# EAGLE design Servo2015_Power_V1.2 (EAGLE 6.3)

## Sheet 1 of 4
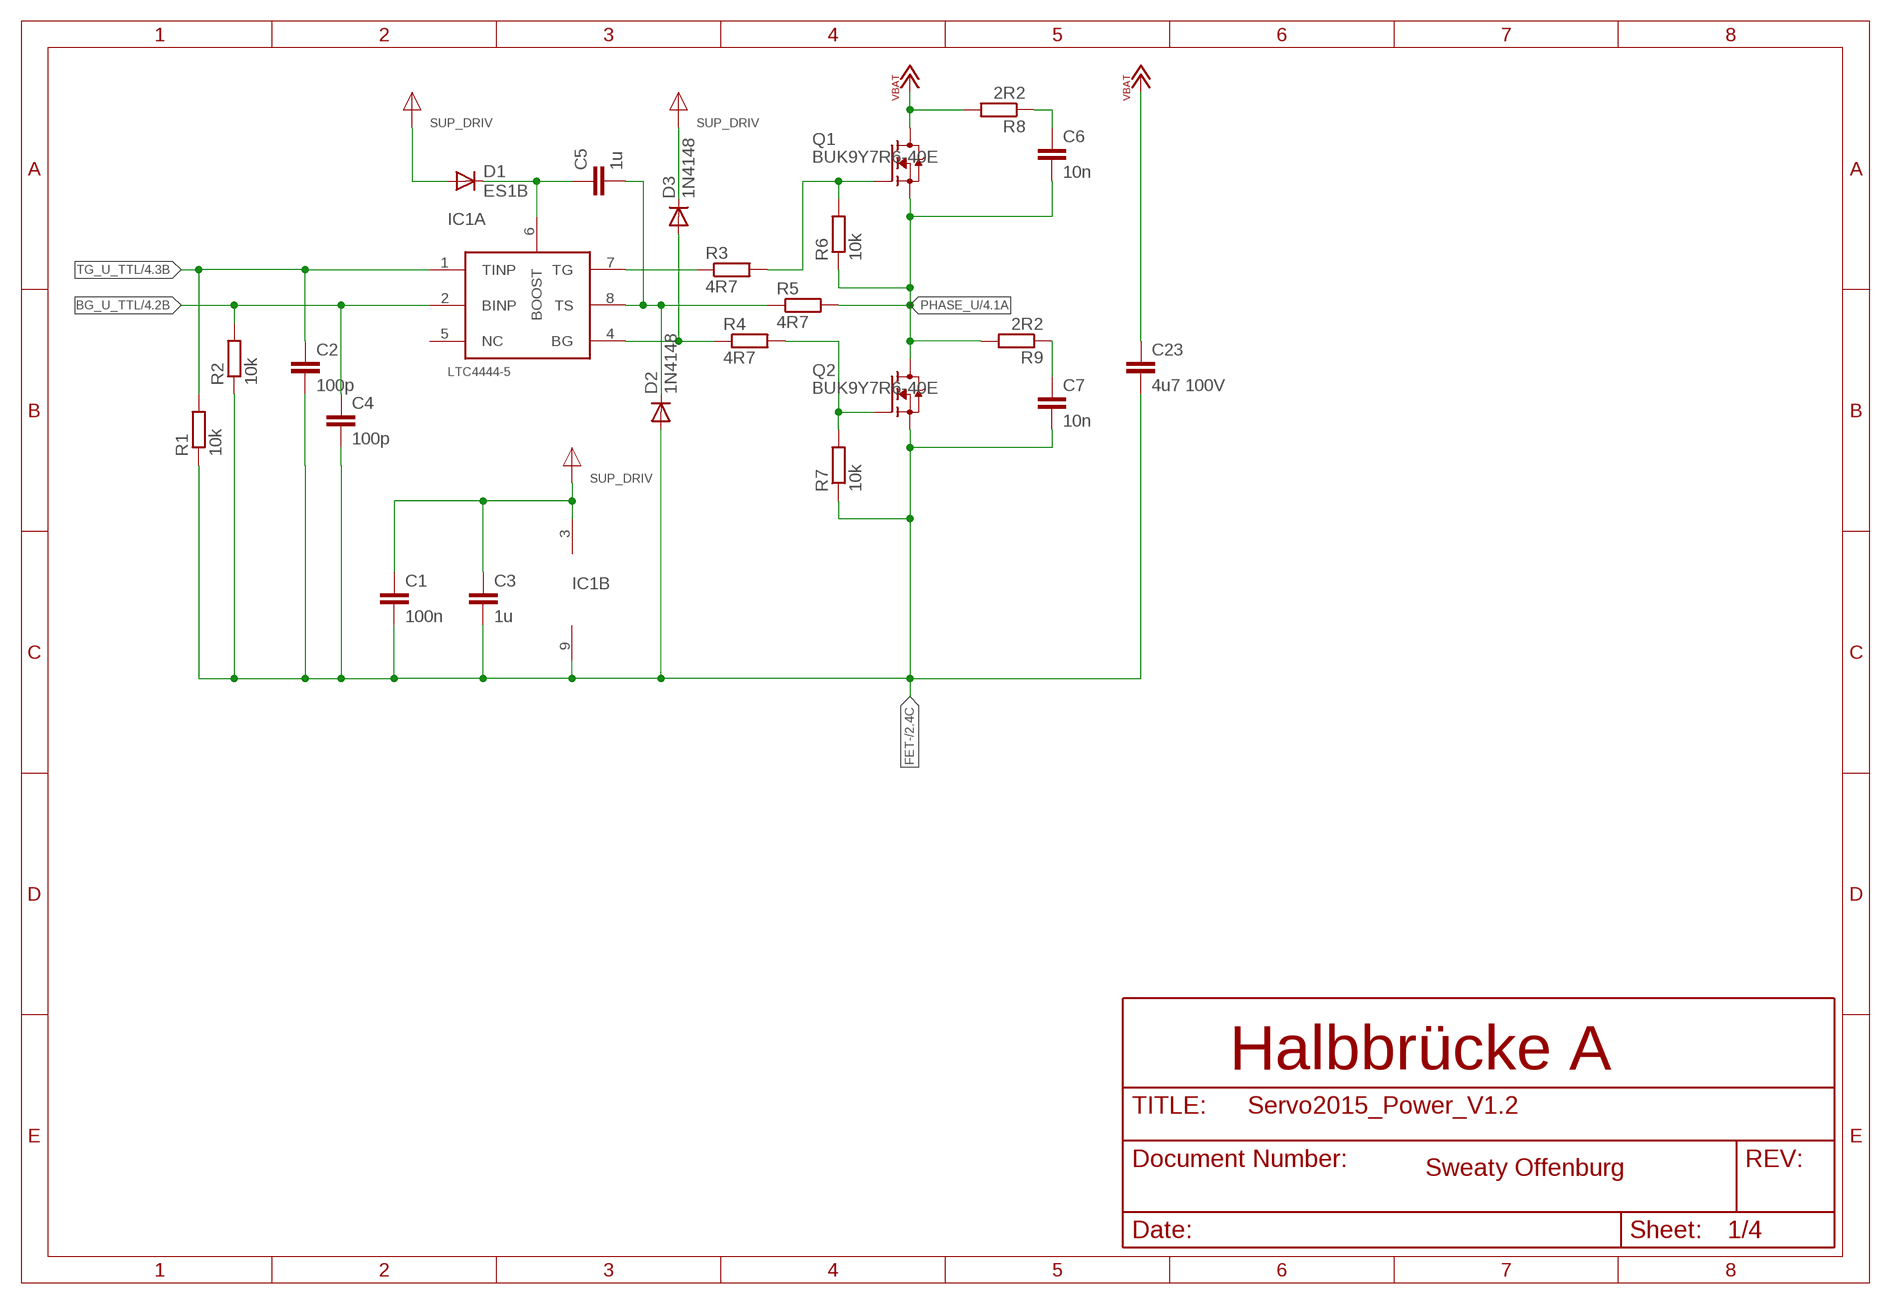
[diagram p0: schematic, sheet 1]

### Parts
C1  100n  C-EUC0603  [C0603]
C2  100p  C-EUC0603  [C0603]
C3  1u  C-EUC0603  [C0603]
C4  100p  C-EUC0603  [C0603]
C5  1u  C-EUC0603  [C0603]
C6  10n  C-EUC1210  [C1210]
C7  10n  C-EUC1210  [C1210]
C23  4u7 100V  C-EUC2220K  [C2220K]
D1  ES1B  DIODE-DO214AC  [DO214AC]
D2  1N4148  DIODE-SOD123  [SOD123]
D3  1N4148  DIODE-SOD123  [SOD123]
IC1  LTC4444-5  [MS8E]
Q1  BUK9Y7R6-40E  [LFPAK56]
Q2  BUK9Y7R6-40E  [LFPAK56]
R1  10k  R-EU_R0603  [R0603]
R2  10k  R-EU_R0603  [R0603]
R3  4R7  R-EU_R0805  [R0805]
R4  4R7  R-EU_R0805  [R0805]
R5  4R7  R-EU_R0805  [R0805]
R6  10k  R-EU_R0603  [R0603]
R7  10k  R-EU_R0603  [R0603]
R8  2R2  R-EU_R1206  [R1206]
R9  2R2  R-EU_R1206  [R1206]

### Nets
BG_U_TTL: C4.1 IC1.2(A:BINP) R2.2 ; also sheet 4
BGR_A: Q2.4(G) R4.2 R7.2
FET-: C1.2 C2.2 C3.2 C4.2 C7.2 C23.2 D2.A IC1.9(B:GND) Q2.1(S) Q2.2(S) Q2.3(S) R1.1 R2.1 R7.1 ; also sheet 2,3,4
N$4: IC1.7(A:TG) R3.1
N$5: C5.2 D2.C IC1.8(A:TS) R5.1
N$6: D3.A IC1.4(A:BG) R4.1
N$7: C5.1 D1.C IC1.6(A:BOOST)
N$20: C6.1 R8.1
N$55: C7.1 R9.1
PHASE_U: C6.2 Q1.1(S) Q1.2(S) Q1.3(S) Q2.5-8(D) R5.2 R6.1 R9.2 ; also sheet 4
SUP_DRIV: C1.1 C3.1 D1.A D3.C IC1.3(B:VCC) ; also sheet 2,3,4
TG_U_TTL: C2.1 IC1.1(A:TINP) R1.2 ; also sheet 4
TGR_A: Q1.4(G) R3.2 R6.2
VBAT+: C23.1 Q1.5-8(D) R8.2 ; also sheet 2,3,4
Unconnected: IC1.5(A:NC)

### Notes on the sheet
- Halbbrücke A
- Sweaty Offenburg

## Sheet 2 of 4
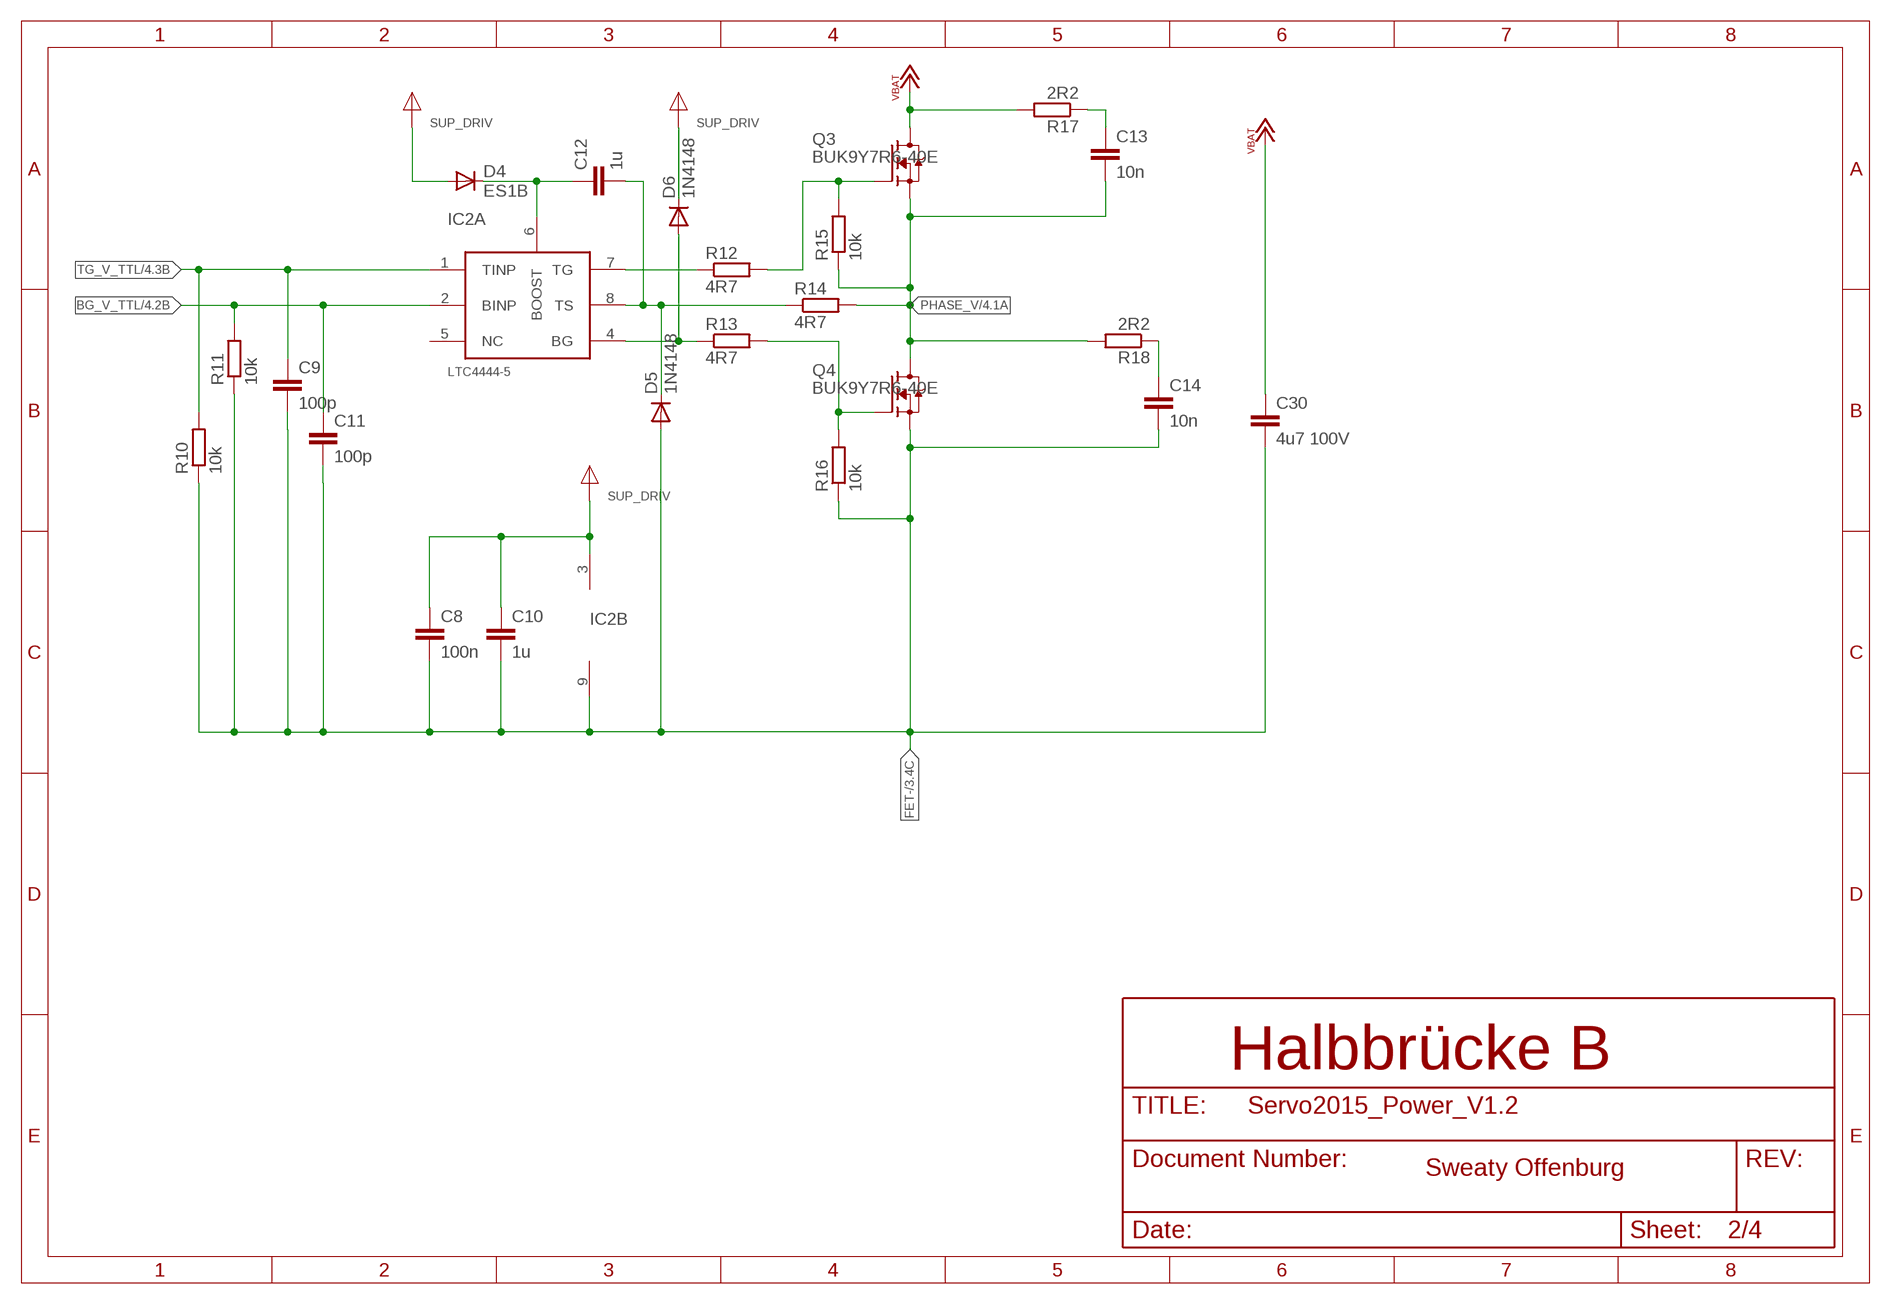
[diagram p1: schematic, sheet 2]

### Parts
C8  100n  C-EUC0603  [C0603]
C9  100p  C-EUC0603  [C0603]
C10  1u  C-EUC0603  [C0603]
C11  100p  C-EUC0603  [C0603]
C12  1u  C-EUC0603  [C0603]
C13  10n  C-EUC1210  [C1210]
C14  10n  C-EUC1210  [C1210]
C30  4u7 100V  C-EUC2220K  [C2220K]
D4  ES1B  DIODE-DO214AC  [DO214AC]
D5  1N4148  DIODE-SOD123  [SOD123]
D6  1N4148  DIODE-SOD123  [SOD123]
IC2  LTC4444-5  [MS8E]
Q3  BUK9Y7R6-40E  [LFPAK56]
Q4  BUK9Y7R6-40E  [LFPAK56]
R10  10k  R-EU_R0603  [R0603]
R11  10k  R-EU_R0603  [R0603]
R12  4R7  R-EU_R0805  [R0805]
R13  4R7  R-EU_R0805  [R0805]
R14  4R7  R-EU_R0805  [R0805]
R15  10k  R-EU_R0603  [R0603]
R16  10k  R-EU_R0603  [R0603]
R17  2R2  R-EU_R1206  [R1206]
R18  2R2  R-EU_R1206  [R1206]

### Nets
BG_V_TTL: C11.1 IC2.2(A:BINP) R11.2 ; also sheet 4
BGR_B: Q4.4(G) R13.2 R16.2
FET-: C8.2 C9.2 C10.2 C11.2 C14.2 C30.2 D5.A IC2.9(B:GND) Q4.1(S) Q4.2(S) Q4.3(S) R10.1 R11.1 R16.1 ; also sheet 1,3,4
N$60: IC2.7(A:TG) R12.1
N$61: C12.2 D5.C IC2.8(A:TS) R14.1
N$62: D6.A IC2.4(A:BG) R13.1
N$63: C12.1 D4.C IC2.6(A:BOOST)
N$71: C13.1 R17.1
N$72: C14.1 R18.1
PHASE_V: C13.2 Q3.1(S) Q3.2(S) Q3.3(S) Q4.5-8(D) R14.2 R15.1 R18.2 ; also sheet 4
SUP_DRIV: C8.1 C10.1 D4.A D6.C IC2.3(B:VCC) ; also sheet 1,3,4
TG_V_TTL: C9.1 IC2.1(A:TINP) R10.2 ; also sheet 4
TGR_B: Q3.4(G) R12.2 R15.2
VBAT+: C30.1 Q3.5-8(D) R17.2 ; also sheet 1,3,4
Unconnected: IC2.5(A:NC)

### Notes on the sheet
- Halbbrücke B
- Sweaty Offenburg

## Sheet 3 of 4
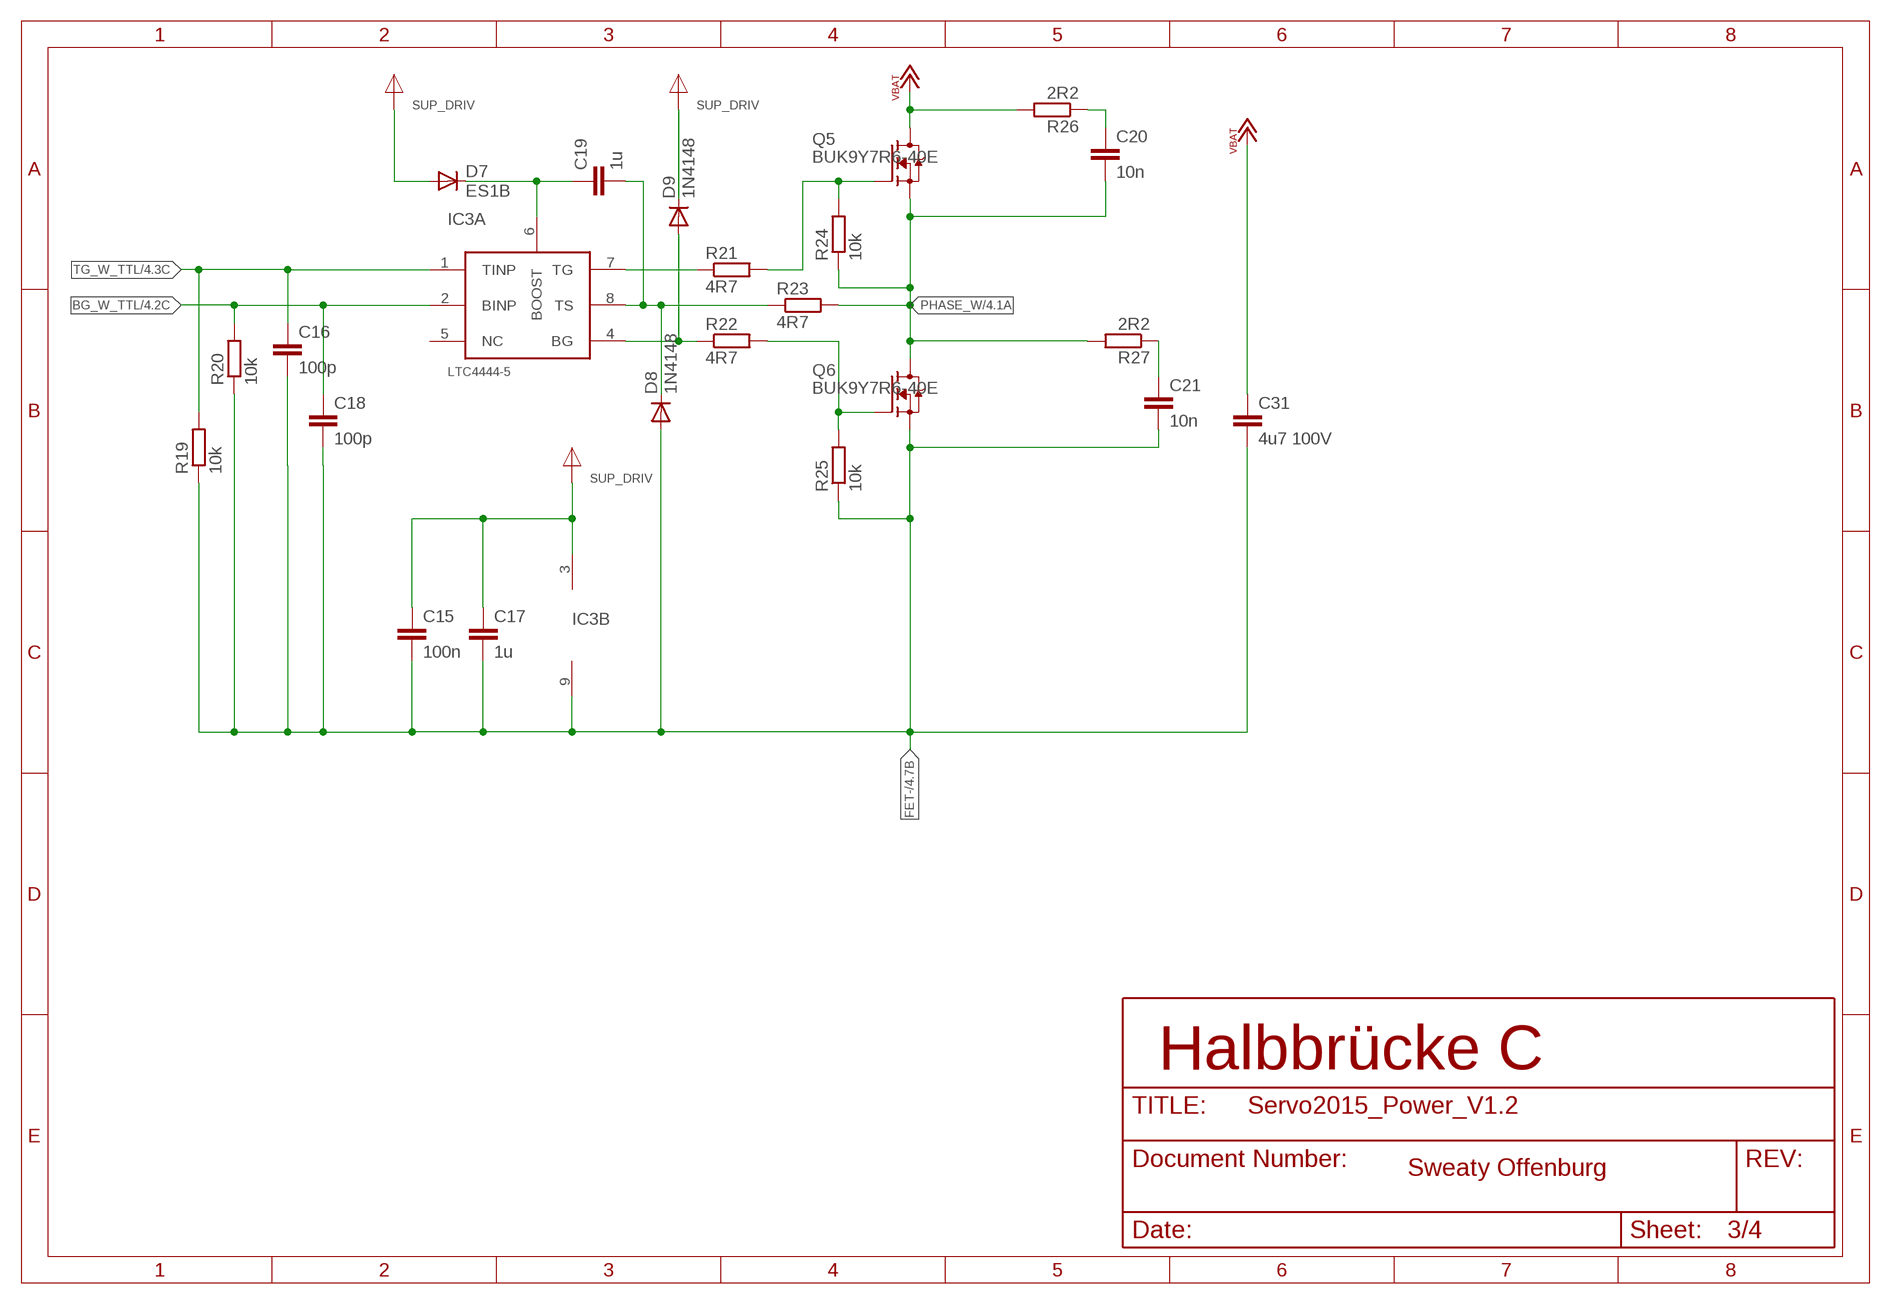
[diagram p2: schematic, sheet 3]

### Parts
C15  100n  C-EUC0603  [C0603]
C16  100p  C-EUC0603  [C0603]
C17  1u  C-EUC0603  [C0603]
C18  100p  C-EUC0603  [C0603]
C19  1u  C-EUC0603  [C0603]
C20  10n  C-EUC1210  [C1210]
C21  10n  C-EUC1210  [C1210]
C31  4u7 100V  C-EUC2220K  [C2220K]
D7  ES1B  DIODE-DO214AC  [DO214AC]
D8  1N4148  DIODE-SOD123  [SOD123]
D9  1N4148  DIODE-SOD123  [SOD123]
IC3  LTC4444-5  [MS8E]
Q5  BUK9Y7R6-40E  [LFPAK56]
Q6  BUK9Y7R6-40E  [LFPAK56]
R19  10k  R-EU_R0603  [R0603]
R20  10k  R-EU_R0603  [R0603]
R21  4R7  R-EU_R0805  [R0805]
R22  4R7  R-EU_R0805  [R0805]
R23  4R7  R-EU_R0805  [R0805]
R24  10k  R-EU_R0603  [R0603]
R25  10k  R-EU_R0603  [R0603]
R26  2R2  R-EU_R1206  [R1206]
R27  2R2  R-EU_R1206  [R1206]

### Nets
BG_W_TTL: C18.1 IC3.2(A:BINP) R20.2 ; also sheet 4
BGR_C: Q6.4(G) R22.2 R25.2
FET-: C15.2 C16.2 C17.2 C18.2 C21.2 C31.2 D8.A IC3.9(B:GND) Q6.1(S) Q6.2(S) Q6.3(S) R19.1 R20.1 R25.1 ; also sheet 1,2,4
N$75: IC3.7(A:TG) R21.1
N$76: C19.2 D8.C IC3.8(A:TS) R23.1
N$77: D9.A IC3.4(A:BG) R22.1
N$78: C19.1 D7.C IC3.6(A:BOOST)
N$86: C20.1 R26.1
N$87: C21.1 R27.1
PHASE_W: C20.2 Q5.1(S) Q5.2(S) Q5.3(S) Q6.5-8(D) R23.2 R24.1 R27.2 ; also sheet 4
SUP_DRIV: C15.1 C17.1 D7.A D9.C IC3.3(B:VCC) ; also sheet 1,2,4
TG_W_TTL: C16.1 IC3.1(A:TINP) R19.2 ; also sheet 4
TGR_C: Q5.4(G) R21.2 R24.2
VBAT+: C31.1 Q5.5-8(D) R26.2 ; also sheet 1,2,4
Unconnected: IC3.5(A:NC)

### Notes on the sheet
- Halbbrücke C
- Sweaty Offenburg

## Sheet 4 of 4
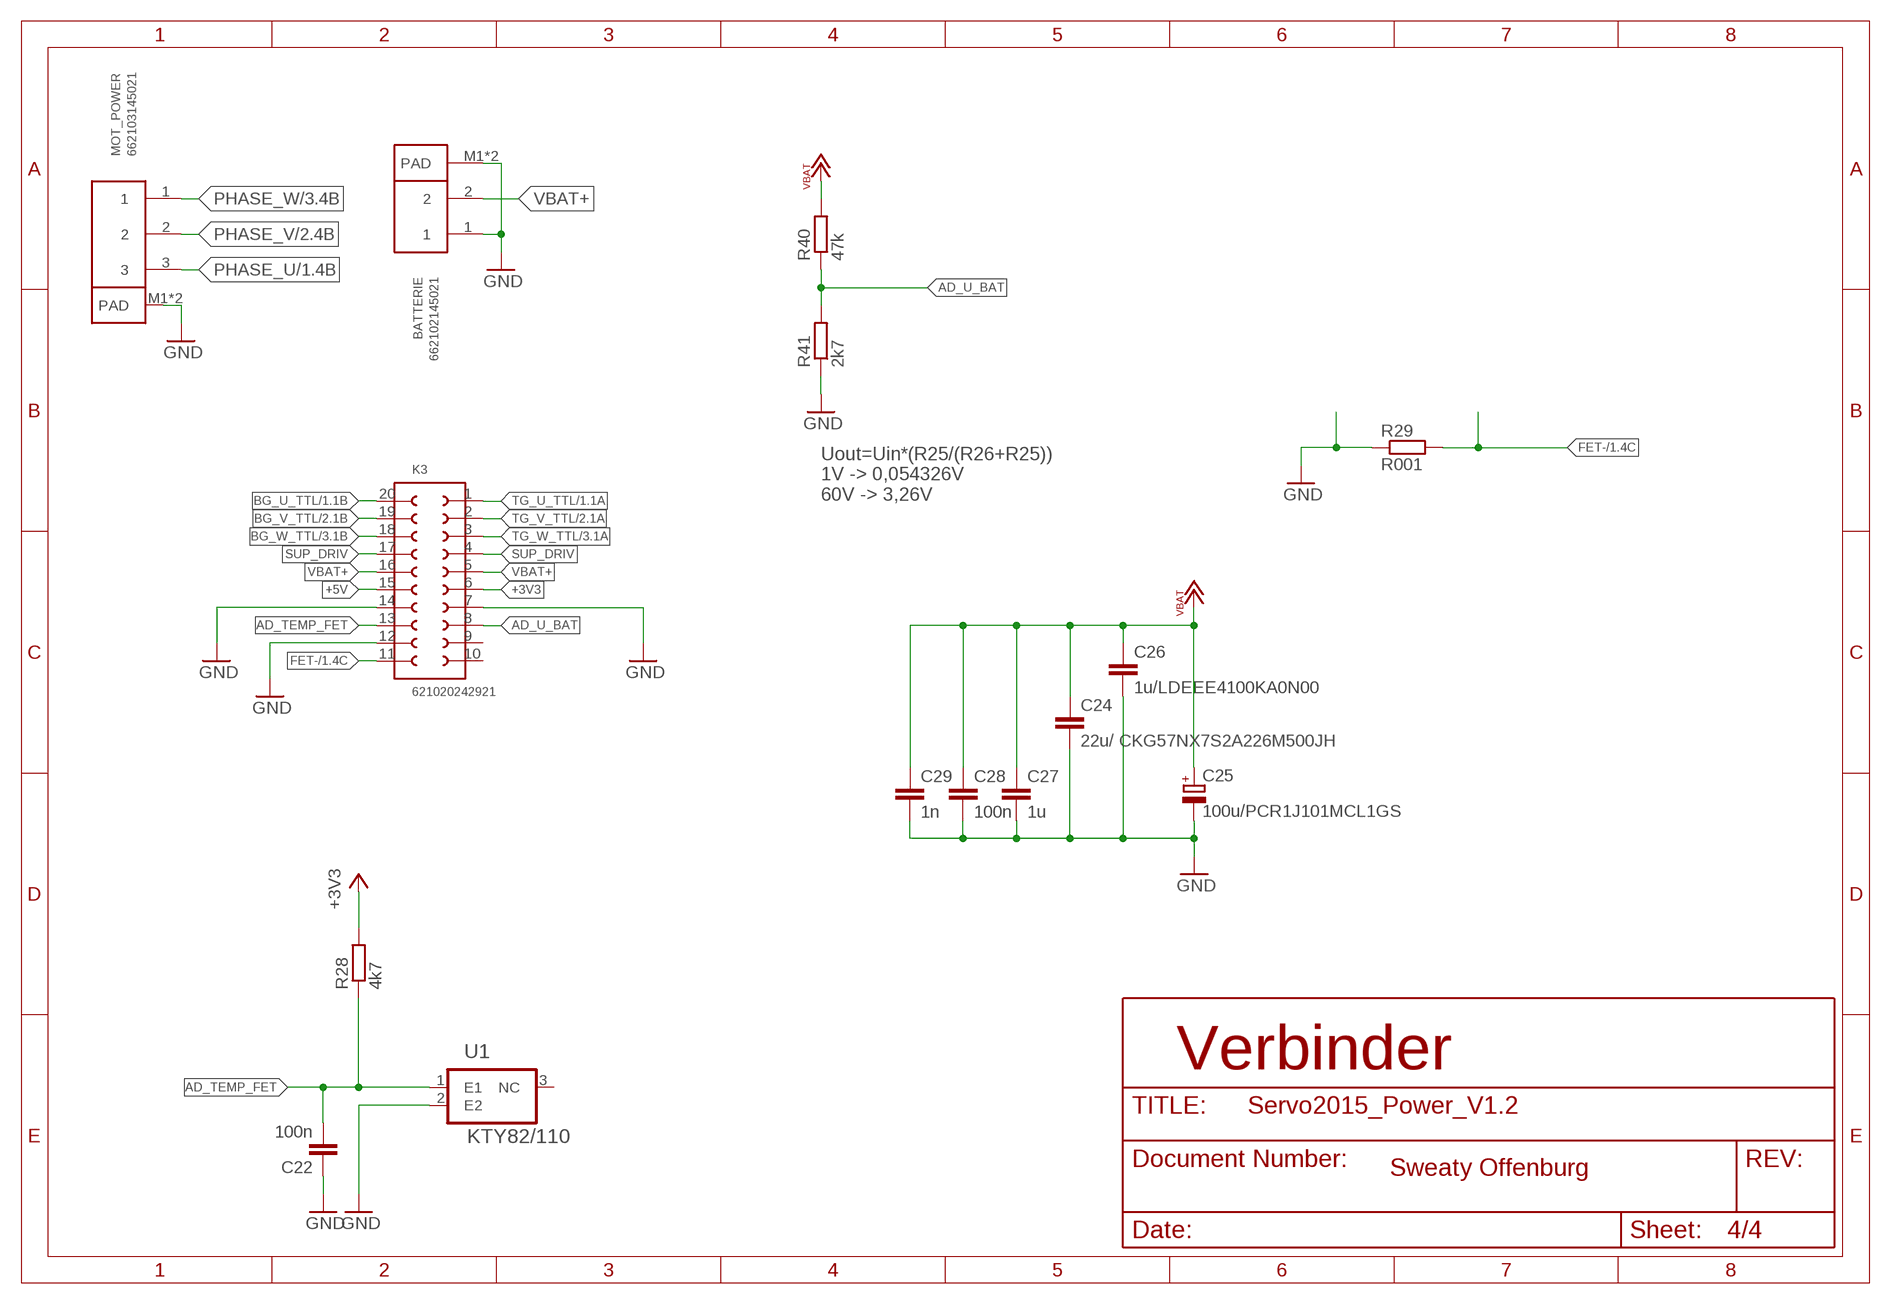
[diagram p3: schematic, sheet 4]

### Parts
BATTERIE  662102145021  [662102145021]
C22  100n  C-EUC0603  [C0603]
C24  22u/ CKG57NX7S2A226M500JH  C-EUCKG57-5750-CC2220  [CKG57-5750-CC2220]
C25  100u/PCR1J101MCL1GS  CPOL-EUG  [PANASONIC_G]
C26  1u/LDEEE4100KA0N00  C-EUC2824*  [C2824]
C27  1u  C-EUC1210  [C1210]
C28  100n  C-EUC0603  [C0603]
C29  1n  C-EUC0603  [C0603]
K3  621020242921  [621020242921]
MOT_POWER  662103145021  [662103145021]
R28  4k7  R-EU_R0603  [R0603]
R29  R001  R-EU_R2512  [R2512]
R40  47k  R-EU_R0603  [R0603]
R41  2k7  R-EU_R0603  [R0603]
U1  KTY82/110  [SOT95P230X110-3N]

### Nets
+3V3: K3.6 R28.2
+5V: K3.15
AD_TEMP_FET: C22.2 K3.13 R28.1 U1.1(E1)
AD_U_BAT: K3.8 R40.1 R41.2
BG_U_TTL: K3.20 ; also sheet 1
BG_V_TTL: K3.19 ; also sheet 2
BG_W_TTL: K3.18 ; also sheet 3
FET-: K3.11 R29.2 ; also sheet 1,2,3
GND: BATTERIE.1 BATTERIE.M1(PAD) BATTERIE.M2(PAD) C22.1 C24.2 C25.- C26.2 C27.2 C28.2 C29.2 K3.7 K3.12 K3.14 MOT_POWER.M1(PAD) MOT_POWER.M2(PAD) R29.1 R41.1 U1.2(E2)
PHASE_U: MOT_POWER.3 ; also sheet 1
PHASE_V: MOT_POWER.2 ; also sheet 2
PHASE_W: MOT_POWER.1 ; also sheet 3
SUP_DRIV: K3.4 K3.17 ; also sheet 1,2,3
TG_U_TTL: K3.1 ; also sheet 1
TG_V_TTL: K3.2 ; also sheet 2
TG_W_TTL: K3.3 ; also sheet 3
VBAT+: BATTERIE.2 C24.1 C25.+ C26.1 C27.1 C28.1 C29.1 K3.5 K3.16 R40.2 ; also sheet 1,2,3
Unconnected: K3.9 K3.10 U1.3(NC)

### Notes on the sheet
- Uout=Uin*(R25/(R26+R25))
  1V -> 0,054326V
  60V -> 3,26V
- Verbinder
- Sweaty Offenburg

## Library data of the parts
BATTERIE = Wurth_Elektronik_Electromechanic_Wire_to_Board_Connectors_rev15b:662102145021: WR-MPC3 3.00mm Male Single Row SMT Angled Header SMT Fitting Nail Clip, 2 Pins=>Code : Con_WTB_MPC3_1_PCB_662102145021 <http://katalog.we-online.de/media/thumbs2/eican/thb_Con_WTB_MPC3_1_PCB_6621xx145021_pf2.jpg> Details see: http://katalog.we-online.de/en/em/662_1xx_145_021 Created 2014-06-06, Karrer Zheng 2014 (C) Würth Elektronik
C1-C23 C27-C31 = rcl:C-EU: CAPACITOR, European symbol
C24 C26 = rcl-eigen:C-EU: CAPACITOR, European symbol
C25 = rcl:CPOL-EU: POLARIZED CAPACITOR, European symbol
D1-D9 = diode:DIODE-: DIODE
IC1-IC3 = LTC4444:LTC4444: GateDriver
K3 = Wurth_Elektronik_Electromechanic_Board_to_Board_Connectors_rev15b:621020242921: WR-PHD 2.00mm Dual SMT Socket Header, 20 Pins=>Code : Con_BTB_SHD_2.00_2_621020242921 <http://katalog.we-online.de/media/thumbs2/eican/thb_Con_BTB_SHD_2.00_2_6210xx242921_pf2.jpg> Details see: http://katalog.we-online.de/en/em/621_0xx_242_921 Created 2014-06-03, Karrer Zheng 2014 (C) Würth Elektronik
MOT_POWER = Wurth_Elektronik_Electromechanic_Wire_to_Board_Connectors_rev15b:662103145021: WR-MPC3 3.00mm Male Single Row SMT Angled Header SMT Fitting Nail Clip, 3 Pins=>Code : Con_WTB_MPC3_1_PCB_6621023145021 <http://katalog.we-online.de/media/thumbs2/eican/thb_Con_WTB_MPC3_1_PCB_6621xx145021_pf2.jpg> Details see: http://katalog.we-online.de/en/em/662_1xx_145_021 Created 2014-06-06, Karrer Zheng 2014 (C) Würth Elektronik
Q1-Q6 = BUK9Y7R6-40E:BUK9Y7R6-40E
R1-R29 R40 R41 = rcl:R-EU_: RESISTOR, European symbol
U1 = KTY-82:KTY82/110: TEMP SENSOR, 3SOT23; MPN: KTY82/110; OC_FARNELL: 2066190; OC_NEWARK: 71T9788; PACKAGE: SOT23; SUPPLIER: NXP

## Board
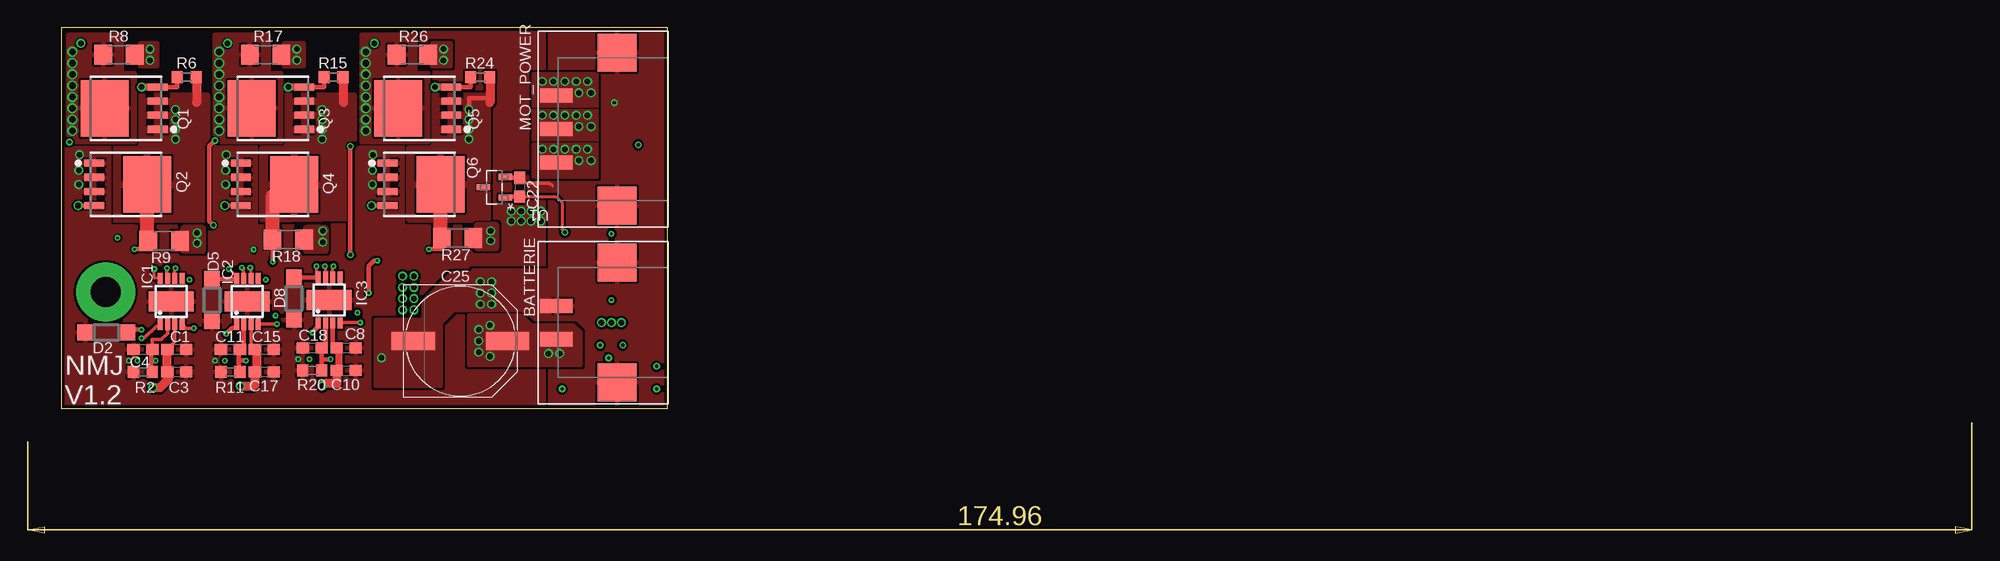
[diagram p4: board, top side]
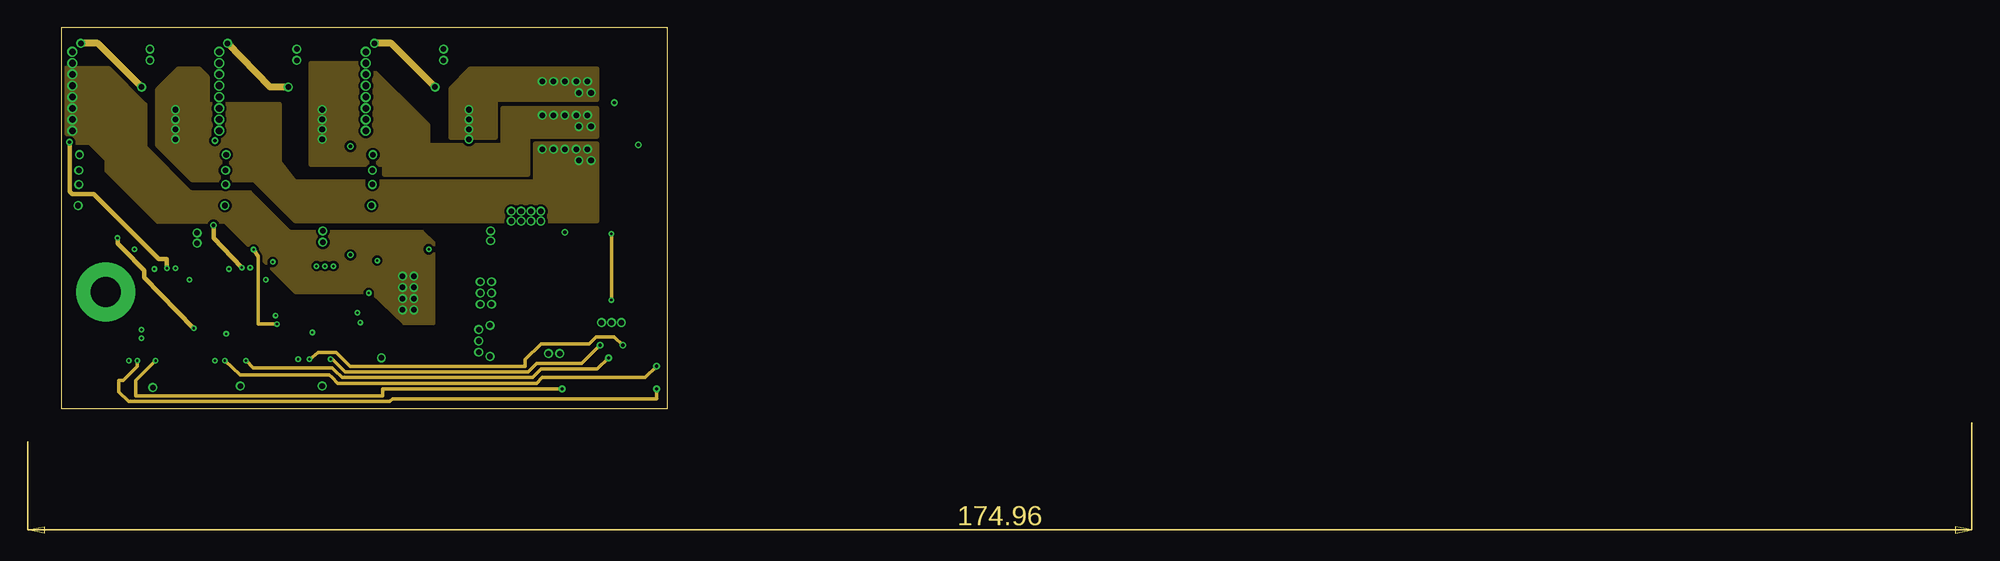
[diagram p5: board, inner layer Route2]
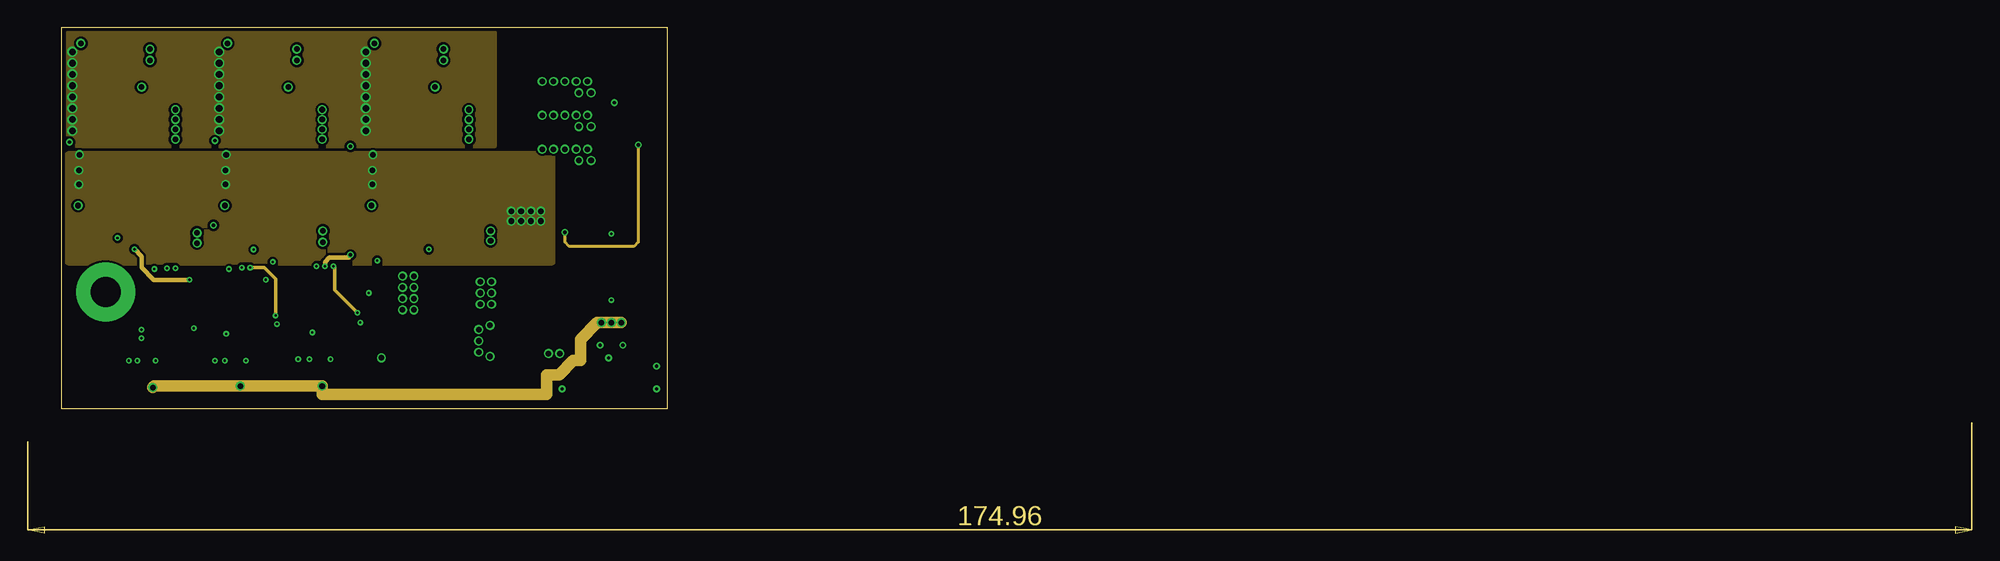
[diagram p6: board, inner layer GND]
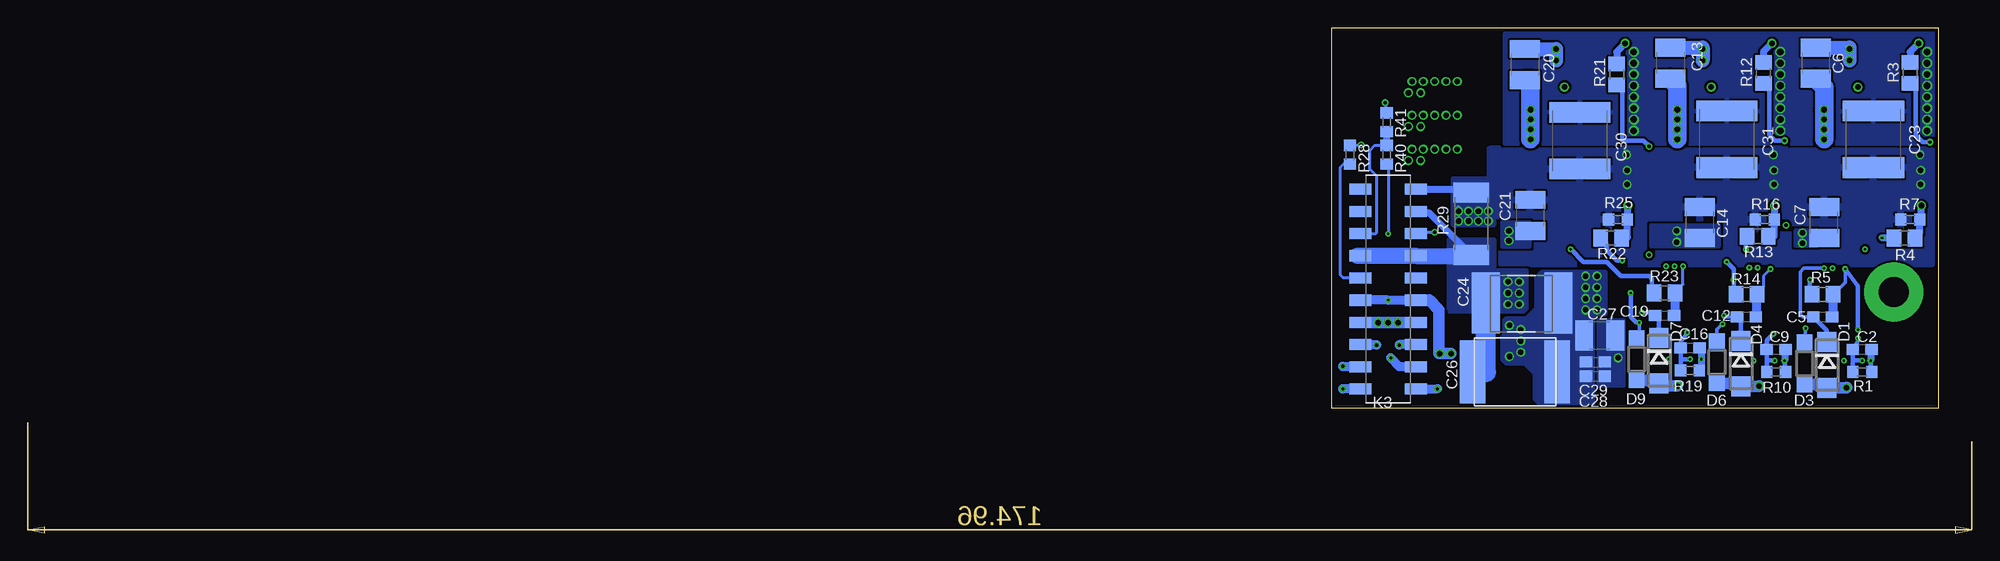
[diagram p7: board, bottom side, seen from below]

Size 54.6 x 34.3 mm. Coordinates in mm from the lower left corner, seen from the top.
Outline: 0,0 54.6,0 54.6,34.3 0,34.3 0,0
Copper layers (1+2*15+16): Top 0.035mm / dielectric 0.36mm / Route2 0.035mm / dielectric 0.71mm / GND 0.035mm / dielectric 0.36mm / Bottom 0.035mm
Design rules "Becker_Müller_4Lagen_Fine": minimum track width 0.12mm, minimum drill 0.15mm, track to track 0.12mm, track to pad 0.12mm, pad to pad 0.12mm, via to via 0.12mm, smd to smd 0.12mm, copper to edge 0.3mm, drill to drill 10mil, minimum pad ring 0.15mm, minimum via ring 0.15mm, stop-mask expansion 0.05mm, vias tented up to drill 0mil, thermal gap 8mil

### Footprints (pad centres in the part's own frame; a part is rotated, then mirrored left to right if it is on the bottom)
662102145021 = smd 1.27 x 2.92: 1 1.5,0; 2 -1.5,0 | smd 3.43 x 3.5: M1 5.395,-5.47; M2 -5.395,-5.47
C0603 = smd 1.1 x 1: 1 -0.85,0; 2 0.85,0
C1210 = smd 1.6 x 2.7: 1 -1.4,0; 2 1.4,0
C2220K = smd 1.85 x 5.5: 1 -2.55,0; 2 2.55,0
CKG57-5750-CC2220 = smd 2.5 x 5.5: 1 -3.25,0; 2 3.25,0
PANASONIC_G = smd 3.9 x 1.6: + 4.25,0; - -4.25,0
C2824 = smd 2.3 x 5.7: 1 -3.8,0; 2 3.8,0
DO214AC = smd 1.8 x 1.7: A 2.05,0; C -2.05,0
SOD123 = smd 1.4 x 1.4: A 1.9,0; C -1.9,0
MS8E = smd 0.45 x 1: 1 -0.975,-2.05; 2 -0.325,-2.05; 3 0.325,-2.05; 4 0.975,-2.05; 5 0.975,2.05; 6 0.325,2.05; 7 -0.325,2.05; 8 -0.975,2.05 | smd 4.06 x 1.83: 9 0,0
621020242921 = smd 1 x 2: 1 -9,2.5; 2 -7,2.5; 3 -5,2.5; 4 -3,2.5; 5 -1,2.5; 6 1,2.5; 7 3,2.5; 8 5,2.5; 9 7,2.5; 10 9,2.5; 11 9,-2.5; 12 7,-2.5; 13 5,-2.5; 14 3,-2.5; 15 1,-2.5; 16 -1,-2.5; 17 -3,-2.5; 18 -5,-2.5; 19 -7,-2.5; 20 -9,-2.5
662103145021 = smd 1.27 x 2.92: 1 1.5,0; 2 -1.5,0; 3 -4.5,0 | smd 3.43 x 3.5: M1 5.395,-5.47; M2 -8.395,-5.47
LFPAK56 = smd 0.635 x 1.778: 1 -1.905,-2.857; 2 -0.635,-2.857; 3 0.635,-2.857; 4 1.905,-2.857 | smd 5.08 x 4.318: 5-8 0,1.905
R0603 = smd 1 x 1.1: 1 -0.85,0; 2 0.85,0
R0805 = smd 1.3 x 1.5: 1 -0.95,0; 2 0.95,0
R1206 = smd 1.6 x 1.803: 1 -1.422,0; 2 1.422,0
R2512 = smd 1.8 x 3.2: 1 -2.8,0; 2 2.8,0
SOT95P230X110-3N = smd 1.219 x 0.559: 1 -0.991,0.94; 2 -0.991,-0.94; 3 0.991,0

### Placement (x,y rotation side)
BATTERIE  44.58,7.75 90 top
C1  10.41,5.33 0 top
C2  6.86,5.33 0 bottom
C3  10.41,3.3 0 top
C4  7.37,5.33 180 top
C5  10.41,8.26 0 bottom
C6  11.05,31.11 270 bottom
C7  10.29,16.76 90 bottom
C8  25.65,5.46 0 top
C9  14.61,5.33 0 bottom
C10  25.65,3.43 0 top
C11  15.24,5.33 180 top
C12  17.27,8.26 0 bottom
C13  24.13,31.11 270 bottom
C14  21.46,16.76 90 bottom
C15  18.29,5.33 0 top
C16  22.35,5.46 0 bottom
C17  18.29,3.3 0 top
C18  22.61,5.46 180 top
C19  24.64,8.38 0 bottom
C20  37.21,30.99 270 bottom
C21  36.7,17.4 90 bottom
C22  41.27,19.94 270 top
C23  5.84,24.26 270 bottom
C24  37.47,9.53 180 bottom
C25  35.94,6.1 0 top
C26  38.1,3.3 180 bottom
C27  30.48,6.6 0 bottom
C28  30.86,2.92 0 bottom
C29  30.86,4.19 0 bottom
C30  32.26,24.13 270 bottom
C31  19.05,24.26 270 bottom
D1  10.03,3.94 270 bottom
D2  4.06,6.86 180 top
D3  12.06,4.06 90 bottom
D4  17.78,4.06 270 bottom
D5  13.59,9.78 270 top
D6  19.94,4.19 90 bottom
D7  25.15,4.32 270 bottom
D8  20.95,9.91 270 top
D9  27.18,4.45 90 bottom
IC1  9.91,9.65 0 top
IC2  16.76,9.65 0 top
IC3  24.13,9.78 0 top
K3  49.53,10.76 90 bottom
MOT_POWER  44.58,26.67 90 top
Q1  5.84,27.05 90 top
Q2  5.84,20.19 270 top
Q3  19.05,27.05 90 top
Q4  19.05,20.19 270 top
Q5  32.26,27.05 90 top
Q6  32.26,20.19 270 top
R1  6.86,3.3 180 bottom
R2  7.37,3.3 0 top
R3  2.54,30.23 90 bottom
R4  3.05,15.37 0 bottom
R5  10.41,10.29 180 bottom
R6  11.3,29.84 180 top
R7  2.54,17.02 0 bottom
R8  5.21,31.88 180 top
R9  9.27,15.11 180 top
R10  14.61,3.3 180 bottom
R11  15.24,3.3 0 top
R12  15.75,30.23 90 bottom
R13  16.26,15.52 0 bottom
R14  17.27,10.29 180 bottom
R15  24.51,29.84 180 top
R16  15.62,17.02 0 bottom
R17  18.41,31.88 180 top
R18  20.45,15.24 180 top
R19  22.35,3.43 180 bottom
R20  22.61,3.43 0 top
R21  28.96,30.1 90 bottom
R22  29.46,15.37 0 bottom
R23  24.64,10.41 180 bottom
R24  37.72,29.84 180 top
R25  28.83,17.02 0 bottom
R26  31.62,31.88 180 top
R27  35.69,15.37 180 top
R28  52.96,22.86 270 bottom
R29  42.04,16.64 90 bottom
R40  49.66,22.86 270 bottom
R41  49.66,25.78 270 bottom
U1  38.99,19.94 180 top
U$1  [A4L-LOC]  -40.4,-70.65 0 top  (outside the outline)

### Tracks (layer width: path | path; a pad name or v marks a point on that pad's centre or on a via)
+3V3
  Bottom 0.254: R28.2 53.55,22.01 53.85,21.72 53.85,12.06 53.59,11.81 52.08,11.81 K3.6
AD_TEMP_FET  (via drill 0.3)
  Top 0.254: C22.2 44.54,19.09 45.09,18.54 45.09,16.13 v45.34,15.88
  Top 0.406: U1.1 39.98,19.09 C22.2
  GND 0.254: v51.94,23.75 51.94,14.99 51.56,14.61 45.72,14.61 45.34,14.99 v45.34,15.88
  Bottom 0.254: v45.34,15.88 46.92,15.88 K3.13 | R28.1 52.11,23.71 v51.94,23.75
AD_U_BAT
  Bottom 0.254: K3.8 50.66,15.76 50.55,15.88 50.55,20.95 51.18,21.59 51.18,23.24 50.71,23.71 R40.1 50.08,23.88
  Bottom 0.305: 50,23.5 R40.1
  Bottom 0.61: R40.1 R41.2
BG_U_TTL  (via drill 0.2, 0.3)
  Top 0.305: IC1.2 9.58,6.79 9.02,6.22 8.22,6.22 C4.1
  Top 0.406: C4.1 8.13,5.33 8.13,4.32 | 8.13,4.32 8.13,3.3 R2.2 | v8.51,4.32 8.13,4.32
  Route2 0.305: v8.51,4.32 6.73,2.54 6.73,1.14 28.96,1.14 28.96,1.78 v45.09,1.78
  Bottom 0.813: K3.20 45.72,1.76 v45.09,1.78
BG_V_TTL  (via drill 0.2, 0.3)
  Top 0.406: IC2.2 16.44,5.68 C11.1 16,5.25 16,4.32 | 16,4.32 16,3.39 R11.2 | 16,4.32 v16.64,4.32
  Route2 0.305: v16.64,4.32 17.27,3.68 24.38,3.68 24.64,3.43 25.27,2.79 42.42,2.79 43.18,3.56 48.26,3.56 v49.28,4.57
  Bottom 0.813: 48.51,3.76 v49.28,4.57 48.51,3.76 | K3.19 48.51,3.76
BG_W_TTL  (via drill 0.2, 0.3)
  Top 0.406: IC3.2 23.8,5.81 C18.1 | C18.1 R20.2 | C18.1 23.46,4.45 v24.26,4.45
  Route2 0.305: v48.51,5.71 46.86,4.06 42.8,4.06 42.04,3.3 41.78,3.3 25.58,3.3 24.94,3.94 24.43,4.45 v24.26,4.45
  Bottom 0.813: 48.51,5.76 v48.51,5.71 48.51,5.76 | K3.18 48.51,5.76
BGR_A  (via drill 0.5)
  Top 0.406: Q2.4 v1.52,18.29
  Bottom 0.61: v1.52,18.29 1.52,17.18 R7.2 1.69,15.78 R4.2
BGR_B  (via drill 0.5)
  Top 0.406: Q4.4 v14.73,18.29
  Bottom 0.61: v14.73,18.29 14.77,18.29 R16.2 14.77,15.54 R13.2
BGR_C  (via drill 0.5)
  Top 0.406: Q6.4 v27.94,18.29
  Bottom 0.61: v27.94,18.29 27.98,18.41 R25.2 27.98,15.44 R22.2
FET-  (via drill 0.2, 0.5)
  Bottom 0.305: 43.18,18.16 v43.18,17.78
  Bottom 0.406: R1.1 6.1,3.39 v6.1,4.32 | R10.1 13.84,3.39 v13.84,4.32 | R19.1 21.59,3.52
  Bottom 0.61: C2.2 6.1,5.25 v6.1,4.32 | C9.2 13.84,5.25 v13.84,4.32 | C16.2 21.34,5.29 v21.34,4.45 21.34,3.6 R19.1 | K3.11 42.04,19.76 R29.2
  other vias: 1.65,22.86 14.86,22.86 28.07,22.86 28.02,21.46 28.02,20.19 14.81,21.46 14.81,20.19 1.6,21.46 1.6,20.19 40.51,17.78 41.4,17.78 42.29,17.78 40.51,16.89 41.4,16.89 42.29,16.89 43.18,16.89
  pour Top (isolate 0.152, rank 2): 0.64,23.88 4.32,23.88 4.32,16.38 6.6,16.38 6.6,13.97 0.64,13.97
  pour Top (rank 2): 13.84,23.88 17.53,23.88 17.53,16.38 19.81,16.38 19.81,13.97 13.84,13.97
  pour Top (rank 2): 27.05,23.88 30.73,23.88 30.73,16.38 33.02,16.38 33.02,13.97 27.05,13.97
  pour Top (isolate 0.203, rank 4): -2.29,37.34 -2.29,-1.27 43.43,-1.27 43.43,37.34
  pour GND (isolate 0.203, rank 2): 0.64,22.86 0.64,13.21 44.2,13.21 44.2,22.86
  pour Bottom (no thermals): 40.01,20.7 43.69,20.7 43.69,16.51 40.01,16.51
  pour Bottom (isolate 0.203, rank 3): 0.38,23.37 40.39,23.37 40.39,17.4 39.37,17.4 39.37,13.08 0.51,13.08
GND  (via drill 0.3, 0.5)
  Top 0.254: C22.1 41.44,20.79 41.91,20.32 43.94,20.32 44.2,20.07 | v49.78,27.56 49.78,27.69
  Top 0.406: 30.35,6.1 C25.- | U1.2 39.98,20.79 C22.1
  Bottom 0.254: R41.1 49.74,26.54 49.74,27.52 v49.78,27.56
  Bottom 0.305: R41.1 49.82,26.63 | K3.12 46.92,17.65 | 43.05,13.84 R29.1
  Bottom 0.61: 46.92,17.65 45.85,17.65 R29.1
  Bottom 1.27: K3.7 51.98,13.72 51.44,13.72 52.32,13.76 | 42.04,13.76 R29.1
  Bottom 1.422: 52.32,13.76 K3.14 42.04,13.76
  Bottom 1.778: C26.2 40.72,3.3 C24.2
  other vias: 37.72,11.43 38.73,10.41 38.73,11.43 37.72,9.4 37.72,10.41 38.73,9.4 28.83,4.57
  pour Bottom (isolate 0.203, rank 2, no thermals): 37.08,12.45 40.01,12.45 40.01,15.24 44.07,15.24 44.07,8.76 37.08,8.76
  pour Top (rank 2, no thermals): 37.08,12.45 43.94,12.45 43.94,8.51 37.08,8.51
  pour Bottom (rank 2, no thermals): 28.32,8 30.61,8 30.61,2.03 28.32,2.03
  pour Top (no thermals): 28.32,8 34.16,8 34.16,2.03 28.32,2.03
  pour Top (rank 2): 35.18,12.19 40.13,12.19 40.13,8.89 35.81,8.89 35.31,8.89 33.78,7.37 33.27,7.37 32.64,8 32.64,9.65
  pour Top (isolate 0.203, rank 6): 42,33.66 55.12,33.66 55.12,0.38 42,0.38
N$2  (via drill 2.7 pad 5.3)
  other vias: 4,10.5
N$4  (via drill 0.2, 0.3)
  Top 0.254: IC1.7 9.53,11.76
  Top 0.305: 9.53,11.76 9.53,11.88 v9.53,12.65
  Route2 0.406: v9.53,12.65 9.53,13.46 8.76,13.46 2.92,19.3 1.02,19.3 0.76,19.56 v0.76,24
  Bottom 0.406: v0.76,24 1.4,24 2.03,24.64 2.03,27.43 2.03,28.64 R3.1
N$5  (via drill 0.2)
  Top 0.254: IC1.8 8.38,11.74 v8.38,12.57
  Top 0.406: D2.C 5.96,7.11 v7.24,7.11
  Bottom 0.305: R5.1 8.38,11.34 v8.38,12.57
  Bottom 0.406: v7.24,7.11 7.24,11.05 v8.38,12.57
  Bottom 0.813: C5.2 9.46,8.36 R5.1
N$6  (via drill 0.2)
  Top 0.305: v11.94,7.24 11.24,7.24 IC1.4
  Route2 0.406: v11.94,7.24 7.49,11.81 7.49,12.45 5.59,14.35 5.08,14.86 v5.08,15.37
  Bottom 0.305: D3.A v11.94,7.24
  Bottom 0.61: R4.1 v5.08,15.37
N$7  (via drill 0.2)
  Top 0.254: IC1.6 10.23,12.52 v10.29,12.65
  Bottom 0.305: v10.29,12.65 12.12,12.65 12.45,12.32 12.45,8.51 12.19,8.26 C5.1
  Bottom 0.406: D1.C 10.03,7.02 C5.1
N$20  (via drill 0.5)
  Bottom 1.27: C6.1 8,32.52 v8,31.37
  other vias: 8,32.38
  pour Top (rank 2, no thermals): 7.11,32.89 8.64,32.89 8.64,30.86 7.11,30.86
N$55  (via drill 0.5)
  other vias: 12.24,15.82 12.24,14.91
  pour Top (rank 2, no thermals): 11.05,16.26 12.7,16.26 12.7,14.22 11.05,14.22
  pour Bottom (rank 2, no thermals): 10.92,16.03 12.83,16.03 12.83,14.71 10.92,14.71
N$60  (via drill 0.2, 0.3)
  Top 0.254: IC2.7 16.44,12.63 v16.26,12.7
  Top 0.406: v13.84,24.13 13.34,23.62 13.34,16.89 v13.72,16.51
  Route2 0.406: v16.26,12.7 13.72,15.37 v13.72,16.51
  Bottom 0.406: v13.84,24.13 14.73,24.13 14.99,24.38 15.24,24.64 15.24,27.94 15.24,28.64 R12.1
N$61  (via drill 0.2)
  Top 0.254: IC2.8 15.75,11.74 15.75,11.94 v15.11,12.57
  Top 0.406: D5.C 15.77,11.68 IC2.8
  Bottom 0.254: R14.1 15.75,10.96 15.75,11.94 v15.11,12.57
  Bottom 0.813: C12.2 16.32,8.36 R14.1
N$62  (via drill 0.2)
  Top 0.305: v19.43,7.62 17.76,7.62 IC2.4
  Route2 0.305: v17.32,14.33 17.74,13.68 IC2.4 17.76,7.62 v19.43,7.62
  Bottom 0.305: D6.A 19.94,7.11 v19.43,7.62
  Bottom 0.406: v17.32,14.33 17.32,15.25 R13.1
  Bottom 0.61: R13.1 17.38,15.75
N$63  (via drill 0.2)
  Top 0.254: IC2.6 17.09,12.52 v17.02,12.7
  GND 0.305: v17.02,12.7 18.29,12.7 18.92,12.06 19.3,11.68 v19.3,8.38
  Bottom 0.305: v19.3,8.38 19.18,8.26 C12.1
  Bottom 0.406: D4.C 17.78,7.91 C12.1
N$71  (via drill 0.5)
  Bottom 1.27: C13.1 21.21,32.52 v21.21,31.37
  other vias: 21.21,32.38
  pour Top (rank 2, no thermals): 20.07,32.89 21.84,32.89 21.84,30.86 20.07,30.86
N$72  (via drill 0.5)
  other vias: 23.55,16 23.55,14.99
  pour Top (rank 2, no thermals): 22.1,16.26 23.75,16.26 23.75,14.22 22.1,14.22
  pour Bottom (rank 2, no thermals): 19.68,16.51 25.91,16.51 25.91,14.61 19.68,14.61
N$75  (via drill 0.2, 0.3)
  Top 0.254: 23.88,11.9 IC3.7 23.8,12.76 v23.75,12.83
  Top 0.406: v26.04,23.62 v26.04,13.84
  GND 0.406: v26.04,13.84 25.91,13.59 24.13,13.59 23.75,13.21 v23.75,12.83
  Bottom 0.406: v26.04,23.62 26.54,24.13 28.45,24.13 28.45,28.64 R21.1
N$76  (via drill 0.2)
  Top 0.254: IC3.8 22.99,11.87 v22.99,12.83
  Top 0.406: D8.C 23.13,11.81 IC3.8
  Bottom 0.254: R23.1 22.99,11.21 v22.99,12.83
  Bottom 0.813: C19.2 23.69,8.48 R23.1
N$77  (via drill 0.2)
  Top 0.305: v26.92,7.75 25.12,7.75 IC3.4
  Top 0.406: v28.45,13.34 28.19,13.34 27.69,12.83 v27.69,10.41
  Bottom 0.305: D9.A 26.92,6.6 v26.92,7.75
  Bottom 0.406: v28.45,13.34 28.96,13.34 29.84,14.22 29.84,14.73 30.41,15.3 R22.1 30.41,15.17 | v27.69,10.41 27.69,8.26 27.18,7.75 v26.92,7.75
N$78  (via drill 0.2)
  Top 0.254: IC3.6 24.45,12.77 v24.51,12.83
  GND 0.305: v26.67,8.64 24.64,10.67 24.64,12.7 24.51,12.7 v24.51,12.83
  Bottom 0.305: v26.67,8.64 25.74,8.64 C19.1
  Bottom 0.406: D7.C 25.15,8.04 C19.1
N$86  (via drill 0.5)
  Bottom 1.27: C20.1 v34.42,32.39 v34.42,31.37
  pour Top (rank 2, no thermals): 33.4,32.89 35.05,32.89 35.05,30.86 33.4,30.86
N$87  (via drill 0.5)
  other vias: 38.66,16 38.66,15.11
  pour Top (rank 2, no thermals): 37.47,16.51 39.12,16.51 39.12,14.48 37.47,14.48
  pour Bottom (rank 2, no thermals): 36.83,16.76 39.24,16.76 39.24,14.61 36.83,14.61
PHASE_U  (via drill 0.2, 0.5)
  Top 0.406: R9.2 7.87,14.35 v6.6,14.35
  Top 0.813: R6.1 12.18,29.84 12.18,27.56
  Top 1.27: R9.2 7.75,15.24 Q2.5-8
  GND 0.406: v11.56,11.6 8.34,11.6 7.24,12.7 7.24,13.72 v6.6,14.35
  Bottom 0.406: R5.2 11.56,10.29 v11.56,11.6
  Bottom 1.676: v10.29,24.26 v10.29,26.92 10.29,28.95 C6.2
  other vias: 10.29,26.04 10.29,25.15 43.31,23.37 44.32,23.37 45.34,23.37 46.35,23.37 46.6,22.35 47.7,22.35 47.37,23.37
  pour Top (isolate 0.152, rank 3): 6.73,28.19 13.08,28.19 13.08,17.02 4.95,17.02 4.95,23.5 6.73,23.5
  pour Route2 (isolate 0.203): 48.25,23.88 48.25,16.89 21.08,16.89 17.4,20.57 11.81,20.57 8.64,23.75 8.64,28.7 10.54,30.61 12.45,30.61 13.21,29.84 13.21,27.56 13.34,27.43 19.68,27.43 19.68,22.23 21.08,20.45 42.67,20.45 42.67,23.88
  pour Top (rank 2, no thermals): 42.5,23.88 48.25,23.88 48.25,20.83 42.5,20.83
PHASE_V  (via drill 0.2, 0.5)
  Top 0.406: R18.2 19.05,14.86 v19.05,13.21
  Top 0.813: R15.1 25.39,29.84 25.39,27.56
  Top 1.27: R18.2 19.05,19.18 Q4.5-8
  Bottom 0.406: R14.2 18.41,10.29 v18.41,11.6 18.41,12.57 v19.05,13.21
  Bottom 1.676: v23.5,24.26 v23.5,26.92 23.5,29.08 C13.2
  other vias: 23.5,26.04 23.5,25.15 43.31,26.42 44.32,26.42 45.34,26.42 46.35,26.42 46.6,25.4 47.37,26.42 47.7,25.4
  pour Top (rank 3): 19.94,28.19 26.29,28.19 26.29,17.14 18.16,17.02 18.16,23.5 19.94,23.5
  pour Route2 (isolate 0.203): 48.25,27.05 48.25,24.51 42.04,24.51 42.04,21.08 29.08,21.08 29.08,21.97 22.48,21.97 22.48,31.11 27.43,31.11 33.02,25.53 33.02,23.75 39.75,23.75 39.75,27.05
  pour Top (rank 3, no thermals): 42.5,26.92 48.25,26.92 48.25,24.13 42.5,24.13
PHASE_W  (via drill 0.2, 0.5)
  Top 0.406: R27.2 34.29,14.35 v33.1,14.35 | R24.1 38.61,29.84 38.61,27.94 36.7,27.94 v36.7,26.92
  Top 0.813: R24.1 38.6,29.84 38.6,27.56
  Top 1.27: R27.2 34.16,15.24 Q6.5-8
  Bottom 0.406: R23.2 25.78,10.41 25.78,11.68 26.04,11.94 28.57,11.94 29.84,13.21 31.95,13.21 v33.1,14.35
  Bottom 1.676: v36.7,24.26 v36.7,26.92 36.7,29.59 C20.2
  other vias: 36.7,26.04 36.7,25.15 43.31,29.46 44.32,29.46 45.34,29.46 46.35,29.46 46.6,28.45 47.7,28.45 47.37,29.46
  pour Top (rank 3): 33.15,28.19 38.35,28.19 38.35,17.02 31.37,17.02 31.37,23.5 33.15,23.5
  pour Route2: 48.25,30.61 48.25,27.81 39.12,27.81 39.12,24.38 35.05,24.38 35.05,28.83 36.83,30.61
  pour Top (rank 2, no thermals): 42.5,30.23 48.25,30.23 48.25,27.18 42.5,27.18
SUP_DRIV  (via drill 0.5)
  Top 0.305: C1.1 10.23,6 IC1.3 | C15.1 17.09,5.68 IC2.3 | C10.1 24.89,3.43 25.02,3.56
  Top 0.406: IC3.3 24.45,5.81 C8.1
  Top 0.61: C3.1 9.65,3.21 | 25.02,3.56 25.02,5.25 C8.1
  Top 0.813: C3.1 C1.1 | 9.65,3.21 9.65,2.65 8.89,1.89 8.27,1.89 v8.26,1.91 | v16.13,2.03 16.15,2.01 17.27,2.01 17.44,2.18 C17.1 17.63,3.3 17.63,4.42 17.63,5.33 C15.1 | C10.1 24.8,2.27 23.73,2.27 v23.5,2.03
  GND 0.406: 48.26,7.75 v49.53,7.75
  GND 1.016: v8.26,1.91 8.38,2.03 v16.13,2.03 v23.5,2.03 23.5,1.27 26.67,1.27 43.69,1.27 43.69,3.05 44.83,3.05 46.1,4.32 46.74,4.32 46.74,6.22 48.26,7.75 v49.53,7.75 v50.42,7.75
  Bottom 0.406: 48.39,7.75 v48.64,7.75
  Bottom 0.61: D9.C 27.56,2.54
  Bottom 1.016: D3.C 10.31,2.16 D1.A 8.27,1.89 v8.26,1.91 | D6.C 18.06,2.29 D4.A 16.15,2.01 v16.13,2.03 | D9.C 25.42,2.54 D7.A 24.91,2.03 v23.5,2.03 | v48.64,7.75 48.39,7.75 v48.64,7.75 | v48.64,7.75 48.77,7.75 | 48.77,7.75 v49.53,7.75 52.01,7.75 K3.4 | v48.64,7.75 48.77,7.75 | K3.17 47.05,7.75 v48.64,7.75
TG_U_TTL  (via drill 0.2, 0.3)
  Top 0.305: IC1.1 8.93,7.41 8.55,7.41 7.49,6.35 v7.24,6.35
  Route2 0.305: v53.59,1.78 53.59,0.89 48.64,0.89 29.84,0.89 29.59,0.64 6.1,0.64 5.21,1.52 5.21,2.54 5.59,2.54 6.6,3.56 6.86,3.81 v6.86,4.32
  Bottom 0.305: C2.1 7.24,6.06 v7.24,6.35
  Bottom 0.406: C2.1 R1.2 7.71,4.32 v6.86,4.32
  Bottom 0.813: K3.1 53.59,1.76 v53.59,1.78
TG_V_TTL  (via drill 0.2, 0.3)
  Top 0.406: IC2.1 15.79,7.28 15.41,7.28 v14.86,6.73
  Route2 0.305: v14.73,4.32 16.13,3.05 24.13,3.05 24.38,2.79 24.89,2.29 42.8,2.29 43.31,2.79 52.58,2.79 v53.59,3.81
  Bottom 0.406: v14.86,6.73 15.46,6.13 C9.1 R10.2 15.46,4.32 v14.73,4.32
  Bottom 0.813: K3.2 53.59,3.76 v53.59,3.81
TG_W_TTL  (via drill 0.2, 0.3)
  Top 0.406: IC3.1 23.16,7.41 v22.61,6.86
  Route2 0.305: v22.35,4.45 23.11,5.08 24.77,5.08 25.4,4.45 26.04,3.81 41.78,3.81 41.78,4.45 43.18,5.84 47.5,5.84 48.13,6.48 49.78,6.48 v50.55,5.71
  Bottom 0.406: 23.46,3.68 R19.2 23.2,4.45 | 23.2,4.45 C16.1 23.2,6.01 v22.61,6.86 | 23.2,4.45 v22.35,4.45
  Bottom 0.813: K3.3 50.55,5.76 v50.55,5.71
TGR_A  (via drill 0.5)
  Top 0.406: R6.2 10.45,28.96 Q1.4
  Top 0.61: Q1.4 v7.24,28.96
  Route2 0.61: v7.24,28.96 3.3,32.89 v1.78,32.89
  Bottom 0.61: R3.2 2.54,32.13 v1.78,32.89
TGR_B  (via drill 0.5)
  Top 0.406: R15.2 23.66,28.96 Q3.4
  Top 0.61: Q3.4 v20.45,28.96
  Route2 0.61: v20.45,28.96 18.8,28.96 v14.99,32.89
  Bottom 0.61: R12.2 15.75,32.13 v14.99,32.89
TGR_C  (via drill 0.5)
  Top 0.406: R24.2 36.87,28.96 Q5.4
  Top 0.61: Q5.4 v33.66,28.96
  Route2 0.61: v33.66,28.96 29.72,32.89 v28.19,32.89
  Bottom 0.61: R21.2 28.96,32.13 v28.19,32.89
VBAT+  (via drill 0.2, 0.5, 0.6)
  Route2 0.305: v49.53,9.78 v49.53,15.75
  Bottom 0.254: 49.44,15.84 49.44,21.54 R40.2
  Bottom 0.305: 49.53,9.76 v49.53,9.78 | 49.44,15.84 v49.53,15.75
  Bottom 0.813: 45.83,9.76 K3.16 | K3.5 49.53,9.76 K3.16 | K3.16 47.24,9.76 47.24,9.65
  Bottom 1.016: v43.87,4.95 v44.88,4.95 44.96,4.95 44.96,8.89 45.83,9.76
  other vias: 1.02,32.13 1.02,31.11 1.02,30.1 1.02,29.08 1.02,28.07 27.43,32.13 27.43,31.11 27.43,30.1 27.43,29.08 27.43,28.07 14.22,32.13 14.22,31.11 14.22,30.1 14.22,29.08 14.22,28.07 38.61,4.7 31.75,11.94 37.59,7.11 38.61,7.49 37.59,5.08 37.59,6.1 31.75,10.92 31.75,9.91 31.75,8.89 30.73,8.89 30.73,9.91 30.73,10.92 30.73,11.94 1.02,27.05 1.02,26.04 14.22,27.05 14.22,26.04 27.43,27.05 27.43,26.04 27.43,25.02 14.22,25.02 1.02,25.02
  pour Top (isolate 0.152): 0.64,24 0.64,33.66 5.46,33.66 5.46,30.23 6.6,30.23 6.6,24
  pour Top: 27.05,24 27.05,33.66 31.88,33.66 31.88,30.23 33.02,30.23 33.02,24
  pour Top: 13.84,24 13.84,33.66 18.67,33.66 18.67,30.23 19.81,30.23 19.81,24
  pour GND (isolate 0.2): 0.64,33.91 0.64,23.62 39,23.62 39,33.91
  pour Route2 (isolate 0.203): 0.25,30.73 4.32,30.73 7.62,27.43 7.62,23.62 11.68,19.56 17.02,19.56 20.57,16 32.51,16 33.53,14.99 33.53,7.62 30.86,7.62 27.94,10.41 21.08,10.41 14.73,16.76 8.64,16.76 4.06,21.34 4.06,22.35 2.54,23.88 1.27,23.88 0.25,24.89
  pour Top (no thermals): 36.7,8.38 41.4,8.38 42.29,7.49 46.1,7.49 46.74,6.86 46.74,3.94 36.7,3.94
  pour Bottom (isolate 0.203, no thermals): 29.97,12.32 35.69,12.32 36.2,11.81 36.2,9.02 37.08,8.13 38.86,8.13 39.24,7.75 39.24,4.45 38.86,4.06 37.21,4.06 36.32,3.17 36.32,0.89 35.81,0.38 31.11,0.38 31.11,8.51 29.97,8.51
  pour Bottom (isolate 0.203): 0.38,33.78 39,33.78 39,23.88 0.38,23.88

### Text on the board
tPlace: NMJ / V1.2
Document: 105µm | 189µm | 105µm | 760µm | 105µm | Lötstopp beidseitig / Bestückungsdruck beidseitig / Oberfläche chem Gold, alternativ chem. Silber / E-Test / / Nach Möglichkeit Fertigung im Nutzenrahmen / mit Trennstegen, Anordnung 3x2 / Kein bestimmter Nutzenrahmen da Handbestückung / / Wahl der Prepregstärke nach Hersteller und Wirtschaftlichkeit. / Gesamtdicke ca. 1,6 mm / / Kein bestimmter Nutzenrahmen da Handbestückung | 189µm | 105µm